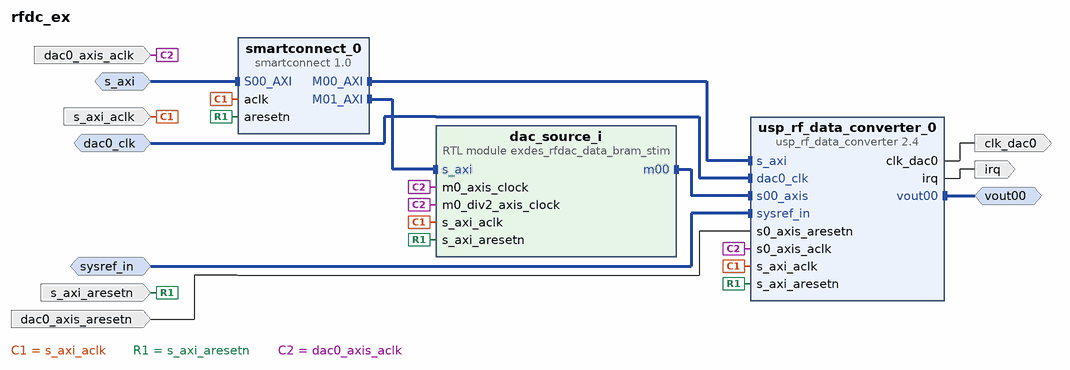
[diagram p0: block diagram of the top level]
# Vivado block design rfdc_ex, xczu28dr-ffvg1517-2-e, Vivado 2020.2
create_bd_design rfdc_ex

create_bd_intf_port -mode Slave -vlnv xilinx.com:interface:aximm_rtl:1.0 s_axi
set_property -dict [list \
  CONFIG.ADDR_WIDTH 32 \
  CONFIG.ARUSER_WIDTH 0 \
  CONFIG.AWUSER_WIDTH 0 \
  CONFIG.BUSER_WIDTH 0 \
  CONFIG.DATA_WIDTH 32 \
  CONFIG.FREQ_HZ 100000000 \
  CONFIG.HAS_BRESP 1 \
  CONFIG.HAS_BURST 1 \
  CONFIG.HAS_CACHE 1 \
  CONFIG.HAS_LOCK 1 \
  CONFIG.HAS_PROT 1 \
  CONFIG.HAS_QOS 1 \
  CONFIG.HAS_REGION 0 \
  CONFIG.HAS_RRESP 1 \
  CONFIG.HAS_WSTRB 1 \
  CONFIG.ID_WIDTH 0 \
  CONFIG.MAX_BURST_LENGTH 1 \
  CONFIG.NUM_READ_OUTSTANDING 2 \
  CONFIG.NUM_READ_THREADS 1 \
  CONFIG.NUM_WRITE_OUTSTANDING 2 \
  CONFIG.NUM_WRITE_THREADS 1 \
  CONFIG.PROTOCOL AXI4LITE \
  CONFIG.READ_WRITE_MODE READ_WRITE \
  CONFIG.RUSER_BITS_PER_BYTE 0 \
  CONFIG.RUSER_WIDTH 0 \
  CONFIG.SUPPORTS_NARROW_BURST 0 \
  CONFIG.WUSER_BITS_PER_BYTE 0 \
  CONFIG.WUSER_WIDTH 0 \
] [get_bd_intf_ports s_axi]
create_bd_intf_port -mode Slave -vlnv xilinx.com:display_usp_rf_data_converter:diff_pins_rtl:1.0 sysref_in
create_bd_intf_port -mode Slave -vlnv xilinx.com:interface:diff_clock_rtl:1.0 dac0_clk
set_property -dict {CONFIG.FREQ_HZ 6400000000} [get_bd_intf_ports dac0_clk]
create_bd_intf_port -mode Master -vlnv xilinx.com:interface:diff_analog_io_rtl:1.0 vout00
create_bd_port -dir I -type clk s_axi_aclk
set_property -dict {CONFIG.FREQ_HZ 100000000} [get_bd_ports s_axi_aclk]
create_bd_port -dir I -type rst s_axi_aresetn
set_property -dict {CONFIG.POLARITY ACTIVE_LOW} [get_bd_ports s_axi_aresetn]
create_bd_port -dir O irq
create_bd_port -dir O -type clk clk_dac0
set_property -dict {CONFIG.FREQ_HZ 50000000} [get_bd_ports clk_dac0]
create_bd_port -dir I -type clk dac0_axis_aclk
set_property -dict {CONFIG.FREQ_HZ 400000000} [get_bd_ports dac0_axis_aclk]
create_bd_port -dir I -type rst dac0_axis_aresetn

create_bd_cell -type ip -vlnv xilinx.com:ip:usp_rf_data_converter:2.4 usp_rf_data_converter_0
set_property -dict [list \
  CONFIG.ADC0_Band 0 \
  CONFIG.ADC1_Band 0 \
  CONFIG.ADC224_En false \
  CONFIG.ADC225_En false \
  CONFIG.ADC226_En false \
  CONFIG.ADC227_En false \
  CONFIG.ADC2_Band 0 \
  CONFIG.ADC3_Band 0 \
  CONFIG.ADC_Mixer_Type01 3 \
  CONFIG.ADC_Mixer_Type03 3 \
  CONFIG.ADC_Mixer_Type11 3 \
  CONFIG.ADC_Mixer_Type13 3 \
  CONFIG.ADC_Mixer_Type21 3 \
  CONFIG.ADC_Mixer_Type23 3 \
  CONFIG.ADC_Mixer_Type31 3 \
  CONFIG.ADC_Mixer_Type33 3 \
  CONFIG.ADC_Slice00_Enable false \
  CONFIG.ADC_Slice02_Enable false \
  CONFIG.ADC_Slice10_Enable false \
  CONFIG.ADC_Slice12_Enable false \
  CONFIG.ADC_Slice20_Enable false \
  CONFIG.ADC_Slice22_Enable false \
  CONFIG.ADC_Slice30_Enable false \
  CONFIG.ADC_Slice32_Enable false \
  CONFIG.AMS_Factory_Var 0 \
  CONFIG.Analog_Detection 1 \
  CONFIG.Axiclk_Freq 100.0 \
  CONFIG.Clock_Forwarding false \
  CONFIG.Converter_Setup 1 \
  CONFIG.DAC0_Band 0 \
  CONFIG.DAC0_Clock_Dist 0 \
  CONFIG.DAC0_Clock_Source 4 \
  CONFIG.DAC0_Multi_Tile_Sync false \
  CONFIG.DAC0_Outclk_Freq 50.000 \
  CONFIG.DAC0_PLL_Enable false \
  CONFIG.DAC0_Refclk_Freq 6400.000 \
  CONFIG.DAC0_Sampling_Rate 6.4 \
  CONFIG.DAC1_Band 0 \
  CONFIG.DAC228_En false \
  CONFIG.DAC229_En false \
  CONFIG.DAC230_En false \
  CONFIG.DAC231_En false \
  CONFIG.DAC2_Band 0 \
  CONFIG.DAC3_Band 0 \
  CONFIG.DAC_Data_Type00 0 \
  CONFIG.DAC_Data_Width00 16 \
  CONFIG.DAC_Debug false \
  CONFIG.DAC_Decoder_Mode00 0 \
  CONFIG.DAC_Interpolation_Mode00 1 \
  CONFIG.DAC_Invsinc_Ctrl00 false \
  CONFIG.DAC_Mixer_Type00 0 \
  CONFIG.DAC_Nyquist00 0 \
  CONFIG.DAC_Output_Current 0 \
  CONFIG.DAC_RTS false \
  CONFIG.DAC_Slice00_Enable true \
  CONFIG.DAC_Slice01_Enable false \
  CONFIG.DAC_Slice02_Enable false \
  CONFIG.DAC_Slice03_Enable false \
  CONFIG.DAC_Slice10_Enable false \
  CONFIG.DAC_Slice11_Enable false \
  CONFIG.DAC_Slice12_Enable false \
  CONFIG.DAC_Slice13_Enable false \
  CONFIG.PRESET None \
  CONFIG.RESERVED_3 110000 \
  CONFIG.RF_Analyzer 0 \
  CONFIG.VNC_Include_Fs2_Change true \
  CONFIG.VNC_Include_OIS_Change true \
  CONFIG.VNC_Testing false \
  CONFIG.disable_bg_cal_en 1 \
  CONFIG.mADC_Band 0 \
  CONFIG.mADC_Mixer_Type01 3 \
  CONFIG.mADC_Mixer_Type03 3 \
  CONFIG.mDAC_Band 0 \
  CONFIG.mDAC_Slice00_Enable false \
  CONFIG.mDAC_Slice01_Enable false \
  CONFIG.mDAC_Slice02_Enable false \
  CONFIG.mDAC_Slice03_Enable false \
  CONFIG.production_simulation 0 \
  CONFIG.tb_adc_fft true \
  CONFIG.tb_dac_fft true \
  CONFIG.use_bram 1 \
] [get_bd_cells usp_rf_data_converter_0]
create_bd_cell -type module -reference exdes_rfdac_data_bram_stim dac_source_i
set_property -dict [list \
  CONFIG.axi_addr_top 14 \
  CONFIG.mem_size 131072 \
  CONFIG.use_div2_clk_0 0 \
  CONFIG.use_div2_clk_1 0 \
  CONFIG.use_div2_clk_2 0 \
  CONFIG.use_div2_clk_3 0 \
] [get_bd_cells dac_source_i]
create_bd_cell -type ip -vlnv xilinx.com:ip:smartconnect:1.0 smartconnect_0
set_property -dict {CONFIG.NUM_MI 2 CONFIG.NUM_SI 1} [get_bd_cells smartconnect_0]

# ---- connections ----

connect_bd_intf_net [get_bd_intf_ports vout00] [get_bd_intf_pins usp_rf_data_converter_0/vout00]
connect_bd_intf_net [get_bd_intf_ports dac0_clk] [get_bd_intf_pins usp_rf_data_converter_0/dac0_clk]
connect_bd_intf_net [get_bd_intf_ports sysref_in] [get_bd_intf_pins usp_rf_data_converter_0/sysref_in]
connect_bd_intf_net [get_bd_intf_pins dac_source_i/m00] [get_bd_intf_pins usp_rf_data_converter_0/s00_axis]
connect_bd_intf_net [get_bd_intf_pins smartconnect_0/M01_AXI] [get_bd_intf_pins dac_source_i/s_axi]
connect_bd_intf_net [get_bd_intf_pins smartconnect_0/M00_AXI] [get_bd_intf_pins usp_rf_data_converter_0/s_axi]
connect_bd_intf_net [get_bd_intf_ports s_axi] [get_bd_intf_pins smartconnect_0/S00_AXI]
connect_bd_net [get_bd_ports s_axi_aclk] \
  [get_bd_pins usp_rf_data_converter_0/s_axi_aclk] [get_bd_pins smartconnect_0/aclk] [get_bd_pins dac_source_i/s_axi_aclk]
connect_bd_net [get_bd_ports s_axi_aresetn] \
  [get_bd_pins usp_rf_data_converter_0/s_axi_aresetn] [get_bd_pins smartconnect_0/aresetn] \
  [get_bd_pins dac_source_i/s_axi_aresetn]
connect_bd_net [get_bd_pins usp_rf_data_converter_0/irq] [get_bd_ports irq]
connect_bd_net [get_bd_pins usp_rf_data_converter_0/clk_dac0] [get_bd_ports clk_dac0]
connect_bd_net [get_bd_ports dac0_axis_aclk] \
  [get_bd_pins usp_rf_data_converter_0/s0_axis_aclk] [get_bd_pins dac_source_i/m0_axis_clock] \
  [get_bd_pins dac_source_i/m0_div2_axis_clock]
connect_bd_net -net s0_axis_aresetn_0_1 [get_bd_ports dac0_axis_aresetn] [get_bd_pins usp_rf_data_converter_0/s0_axis_aresetn]

# ---- address map ----
assign_bd_address -offset 0x44A00000 -range 64K -target_address_space [get_bd_addr_spaces s_axi] [get_bd_addr_segs dac_source_i/s_axi/reg0]
assign_bd_address -offset 0x44A40000 -range 256K -target_address_space [get_bd_addr_spaces s_axi] [get_bd_addr_segs usp_rf_data_converter_0/s_axi/Reg]

validate_bd_design
save_bd_design
